# Altium schematic sheet power.SchDoc
size Letter
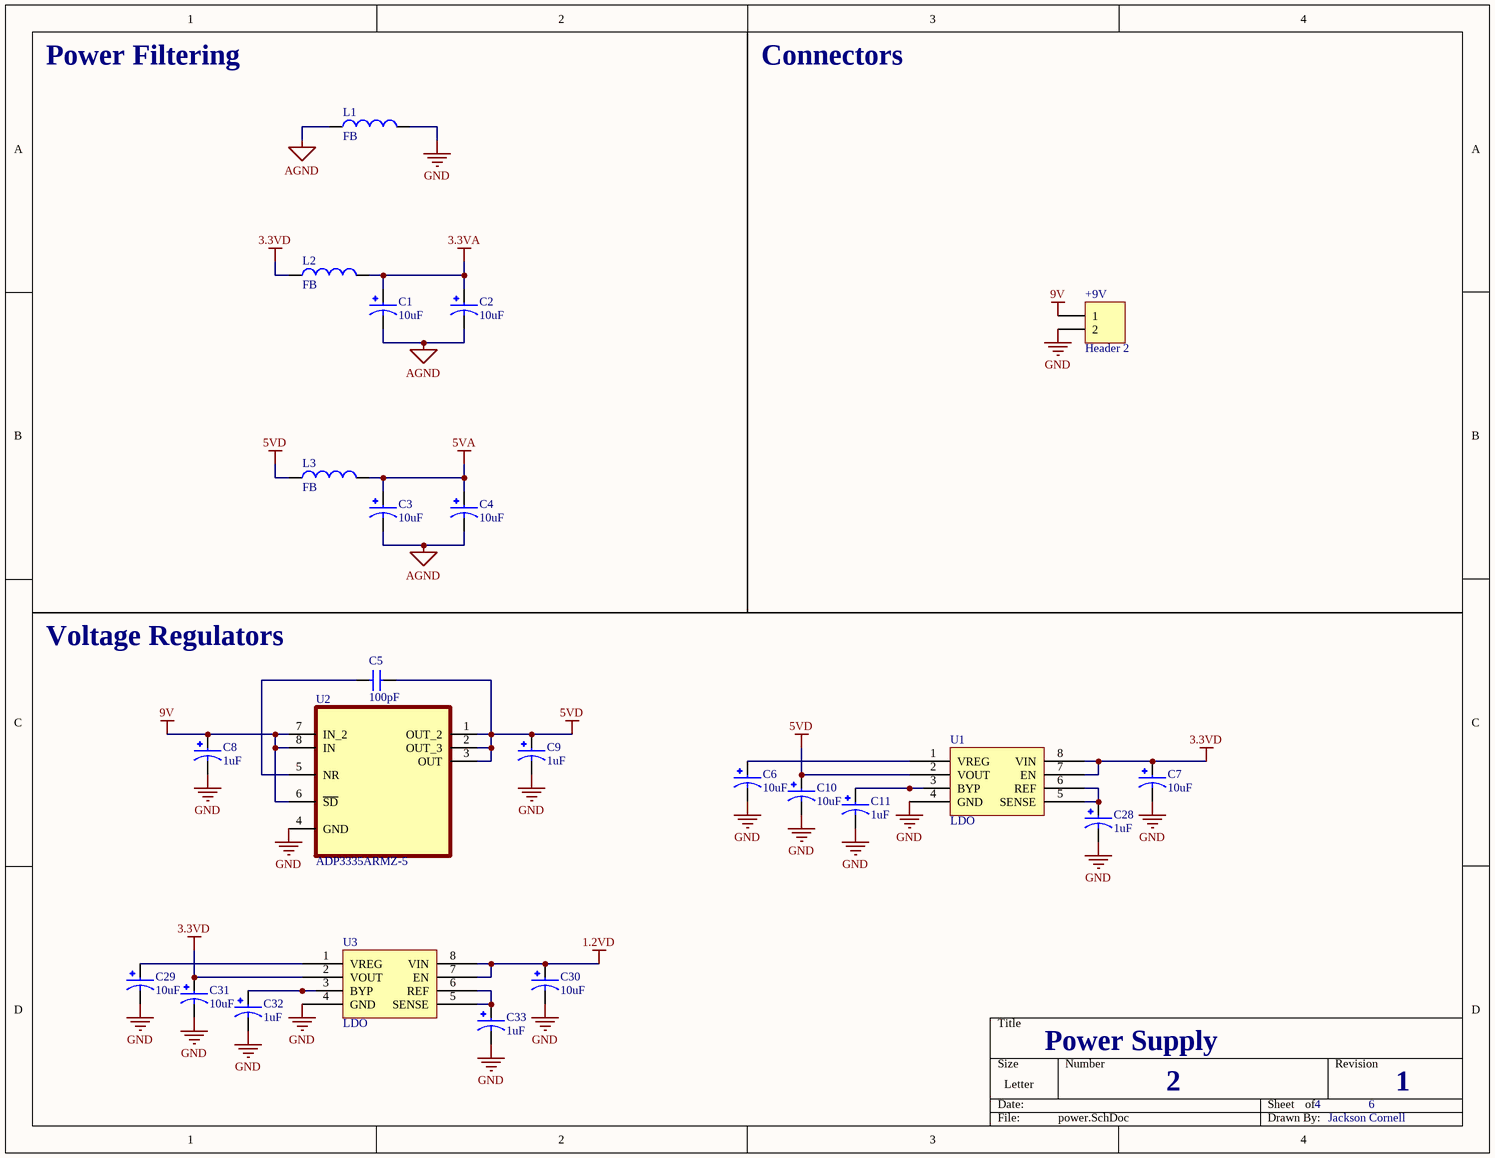
[diagram p0: power.SchDoc]

## Parts
+9V  Header 2  [HDR1X2]
C1  10uF  [CAPPRD500W50D500H1100]
C2  10uF  [CAPPRD500W50D500H1100]
C3  10uF  [CAPPRD500W50D500H1100]
C4  10uF  [CAPPRD500W50D500H1100]
C5  value 100pF  [CAPC0805]  (hidden comment: Cap)
C6  10uF  [CAPPRD500W50D500H1100]
C7  10uF  [CAPPRD500W50D500H1100]
C8  1uF  [CAPPRD500W50D500H1100]
C9  1uF  [CAPPRD500W50D500H1100]
C10  10uF  [CAPPRD500W50D500H1100]
C11  1uF  [CAPPRD500W50D500H1100]
C28  1uF  [CAPPRD500W50D500H1100]
C29  10uF  [CAPPRD500W50D500H1100]
C30  10uF  [CAPPRD500W50D500H1100]
C31  10uF  [CAPPRD500W50D500H1100]
C32  1uF  [CAPPRD500W50D500H1100]
C33  1uF  [CAPPRD500W50D500H1100]
L1  FB  [RES0805]
L2  FB  [RES0805]
L3  FB  [RES0805]
U1  LDO  [SOIC127P600X175-9N]
U2  ADP3335ARMZ-5  [SOP65P490X110-8N]
U3  LDO  [SOIC127P600X175-9N]

## Nets
1.2VD: C30.P U3.7(EN) U3.8(VIN)
3.3VA: C1.P C2.P L2.2
3.3VD: C7.P C31.P L2.1 U1.7(EN) U1.8(VIN) U3.2(VOUT)
5VA: C3.P C4.P L3.2
5VD: C5.2(B) C9.P C10.P L3.1 U1.2(VOUT) U2.1(OUT_2) U2.2(OUT_3) U2.3(OUT)
9V: +9V.1 C8.P U2.6(~{SD}) U2.7(IN_2) U2.8(IN)
AGND: C1.N C2.N C3.N C4.N L1.1
GND: +9V.2 C6.N C7.N C8.N C9.N C10.N C11.N C28.N C29.N C30.N C31.N C32.N C33.N L1.2 U1.4(GND) U2.4(GND) U3.4(GND)
NetC5_1: C5.1(A) U2.5(NR)
NetC6_P: C6.P U1.1(VREG)
NetC11_P: C11.P U1.3(BYP)
NetC28_P: C28.P U1.5(SENSE) U1.6(REF)
NetC29_P: C29.P U3.1(VREG)
NetC32_P: C32.P U3.3(BYP)
NetC33_P: C33.P U3.5(SENSE) U3.6(REF)

## Notes on the sheet
- Power Filtering
- Connectors
- Voltage Regulators
- Power Supply
- 2
- 4
- 6
- 1
- Jackson Cornell

## Library data of the parts
+9V = Header 2: Header, 2-Pin; LatestRevisionDate: 17-Jul-2002; LatestRevisionNote: Re-released for DXP Platform.; Publisher: Altium Limited
C1-C4 C6-C11 C28-C33 = EEUFS0J221B: Aluminum Electrolytic Capacitors, 220uF, 6.3V, -40 to 105C; MF: Panasonic; Check_prices: https://www.snapeda.com/parts/EEUFS0J221B/Panasonic/view-part/5796863/?ref=eda; Availability: In Stock; Price: None; Package: RADIAL-2 Panasonic; Value: *; SnapEDA_Link: https://www.snapeda.com/parts/EEUFS0J221B/Panasonic/view-part/5796863/?ref=snap; Purchase-URL: https://pricing.snapeda.com/search/part/EEUFS0J221B/?ref=eda; MP: EEUFS0J221B
L1-L3 = Inductor: Code_IEC: 1005; Published: 8-Jun-2000; LatestRevisionDate: 29-May-2009; LatestRevisionNote: IPC-7351 Footprint Added.; PackageReference: 0402-A; Publisher: Altium Limited; PackageDescription: Chip Inductor; Code_JEITA: 0402
U1 U3 = ADM7154
U2 = ADP3335ARMZ-3.3: Linear Voltage Regulator IC 1 Output 500mA 8-MSOP; MF: Analog Devices; MP: ADP3335ARMZ-3.3; SnapEDA_Link: https://www.snapeda.com/parts/ADP3335ARMZ-3.3/Analog%20Devices/view-part/674568/?ref=snap; Availability: Unavailable; Package: MSOP-8 Analog Devices; Value: *; Price: None
C5 = Cap: Supplier 1: Digi-Key; Supplier Part Number 1: 1276-1000-1-ND